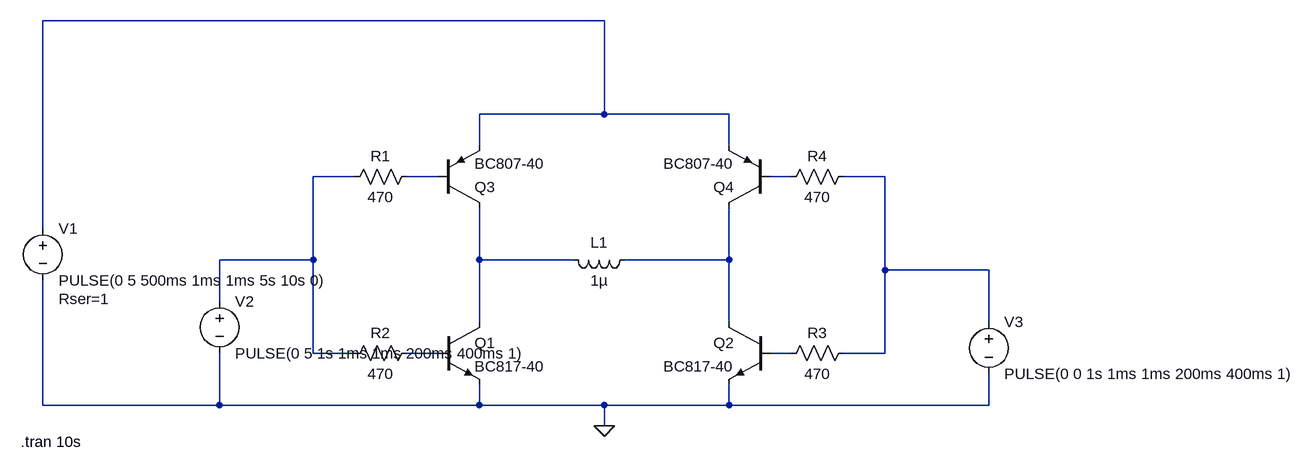
[diagram p0: schematic valveAdapter.asc]
valveAdapter.asc, the LTspice schematic file:
Version 4
SHEET 1 1228 680
WIRE 144 -320 -720 -320
WIRE 144 -176 144 -320
WIRE 144 -176 -48 -176
WIRE 336 -176 144 -176
WIRE -48 -128 -48 -176
WIRE 336 -128 336 -176
WIRE -240 -80 -304 -80
WIRE -112 -80 -160 -80
WIRE 432 -80 400 -80
WIRE 576 -80 512 -80
WIRE -720 0 -720 -320
WIRE -304 48 -304 -80
WIRE -304 48 -448 48
WIRE -48 48 -48 -32
WIRE 96 48 -48 48
WIRE 336 48 336 -32
WIRE 336 48 176 48
WIRE 576 64 576 -80
WIRE 736 64 576 64
WIRE -448 112 -448 48
WIRE -48 144 -48 48
WIRE 336 144 336 48
WIRE 736 144 736 64
WIRE -304 192 -304 48
WIRE -240 192 -304 192
WIRE -112 192 -160 192
WIRE 432 192 400 192
WIRE 576 192 576 64
WIRE 576 192 512 192
WIRE -720 272 -720 80
WIRE -448 272 -448 192
WIRE -448 272 -720 272
WIRE -48 272 -48 240
WIRE -48 272 -448 272
WIRE 144 272 -48 272
WIRE 336 272 336 240
WIRE 336 272 144 272
WIRE 736 272 736 224
WIRE 736 272 336 272
WIRE 144 304 144 272
FLAG 144 304 0
SYMBOL npn -112 144 R0
SYMATTR InstName Q1
SYMATTR Value BC817-40
SYMBOL npn 400 144 M0
SYMATTR InstName Q2
SYMATTR Value BC817-40
SYMBOL pnp -112 -32 M180
SYMATTR InstName Q3
SYMATTR Value BC807-40
SYMBOL pnp 400 -32 R180
SYMATTR InstName Q4
SYMATTR Value BC807-40
SYMBOL res -144 -96 R90
WINDOW 0 0 56 VBottom 2
WINDOW 3 32 56 VTop 2
SYMATTR InstName R1
SYMATTR Value 470
SYMBOL res -144 176 R90
WINDOW 0 0 56 VBottom 2
WINDOW 3 32 56 VTop 2
SYMATTR InstName R2
SYMATTR Value 470
SYMBOL res 416 208 R270
WINDOW 0 32 56 VTop 2
WINDOW 3 0 56 VBottom 2
SYMATTR InstName R3
SYMATTR Value 470
SYMBOL res 416 -64 R270
WINDOW 0 32 56 VTop 2
WINDOW 3 0 56 VBottom 2
SYMATTR InstName R4
SYMATTR Value 470
SYMBOL voltage -720 -16 R0
WINDOW 123 0 0 Left 0
WINDOW 39 24 124 Left 2
SYMATTR InstName V1
SYMATTR Value PULSE(0 5 500ms 1ms 1ms 5s 10s 0)
SYMATTR SpiceLine Rser=1
SYMBOL voltage -448 96 R0
WINDOW 123 0 0 Left 0
WINDOW 39 0 0 Left 0
SYMATTR InstName V2
SYMATTR Value PULSE(0 5 1s 1ms 1ms 200ms 400ms 1)
SYMBOL voltage 736 128 R0
WINDOW 123 0 0 Left 0
WINDOW 39 0 0 Left 0
SYMATTR InstName V3
SYMATTR Value PULSE(0 0 1s 1ms 1ms 200ms 400ms 1)
SYMBOL ind 192 32 R90
WINDOW 0 5 56 VBottom 2
WINDOW 3 32 56 VTop 2
SYMATTR InstName L1
SYMATTR Value 1µ
SYMATTR SpiceLine Rser=10
TEXT -754 328 Left 2 !.tran 10s

The netlist it stands for:
* valveAdapter.asc
Q1 N006 N008 0 0 BC817-40
Q2 N007 N009 0 0 BC817-40
Q3 N006 N003 N001 0 BC807-40
Q4 N007 N004 N001 0 BC807-40
R1 N003 N002 470
R2 N008 N002 470
R3 N009 N005 470
R4 N004 N005 470
V1 N001 0 PULSE(0 5 500ms 1ms 1ms 5s 10s 0) Rser=1
V2 N002 0 PULSE(0 5 1s 1ms 1ms 200ms 400ms 1)
V3 N005 0 PULSE(0 0 1s 1ms 1ms 200ms 400ms 1)
L1 N007 N006 1µ Rser=10
.model NPN NPN
.model PNP PNP
.lib standard.bjt
.tran 10s
.backanno
.end